# Altium schematic sheet Motor_0307.SchDoc: LKS034DO_FOC_MOTOR
size C; Date: 20220518; DrawnBy: WPJ; Organization: PuXun Tech Co.Ltd.; Revision: V1.0; PageSetup: Record=PageOptions?CenterHorizontal=True?CenterVertical=True?PrintScale=0.54?XCorrection=1.00?YCorrection=1.00?PrintKind=0?BorderSize=5000000?LeftOffset=0?BottomOffset=0?Orientation=2?PaperLength=1000?PaperWidth=1000?Scale=100?PaperSource=7?PrintQuality=-4?MediaType=1?DitherType=10?PaperKind=A4?PrintScaleMode=1
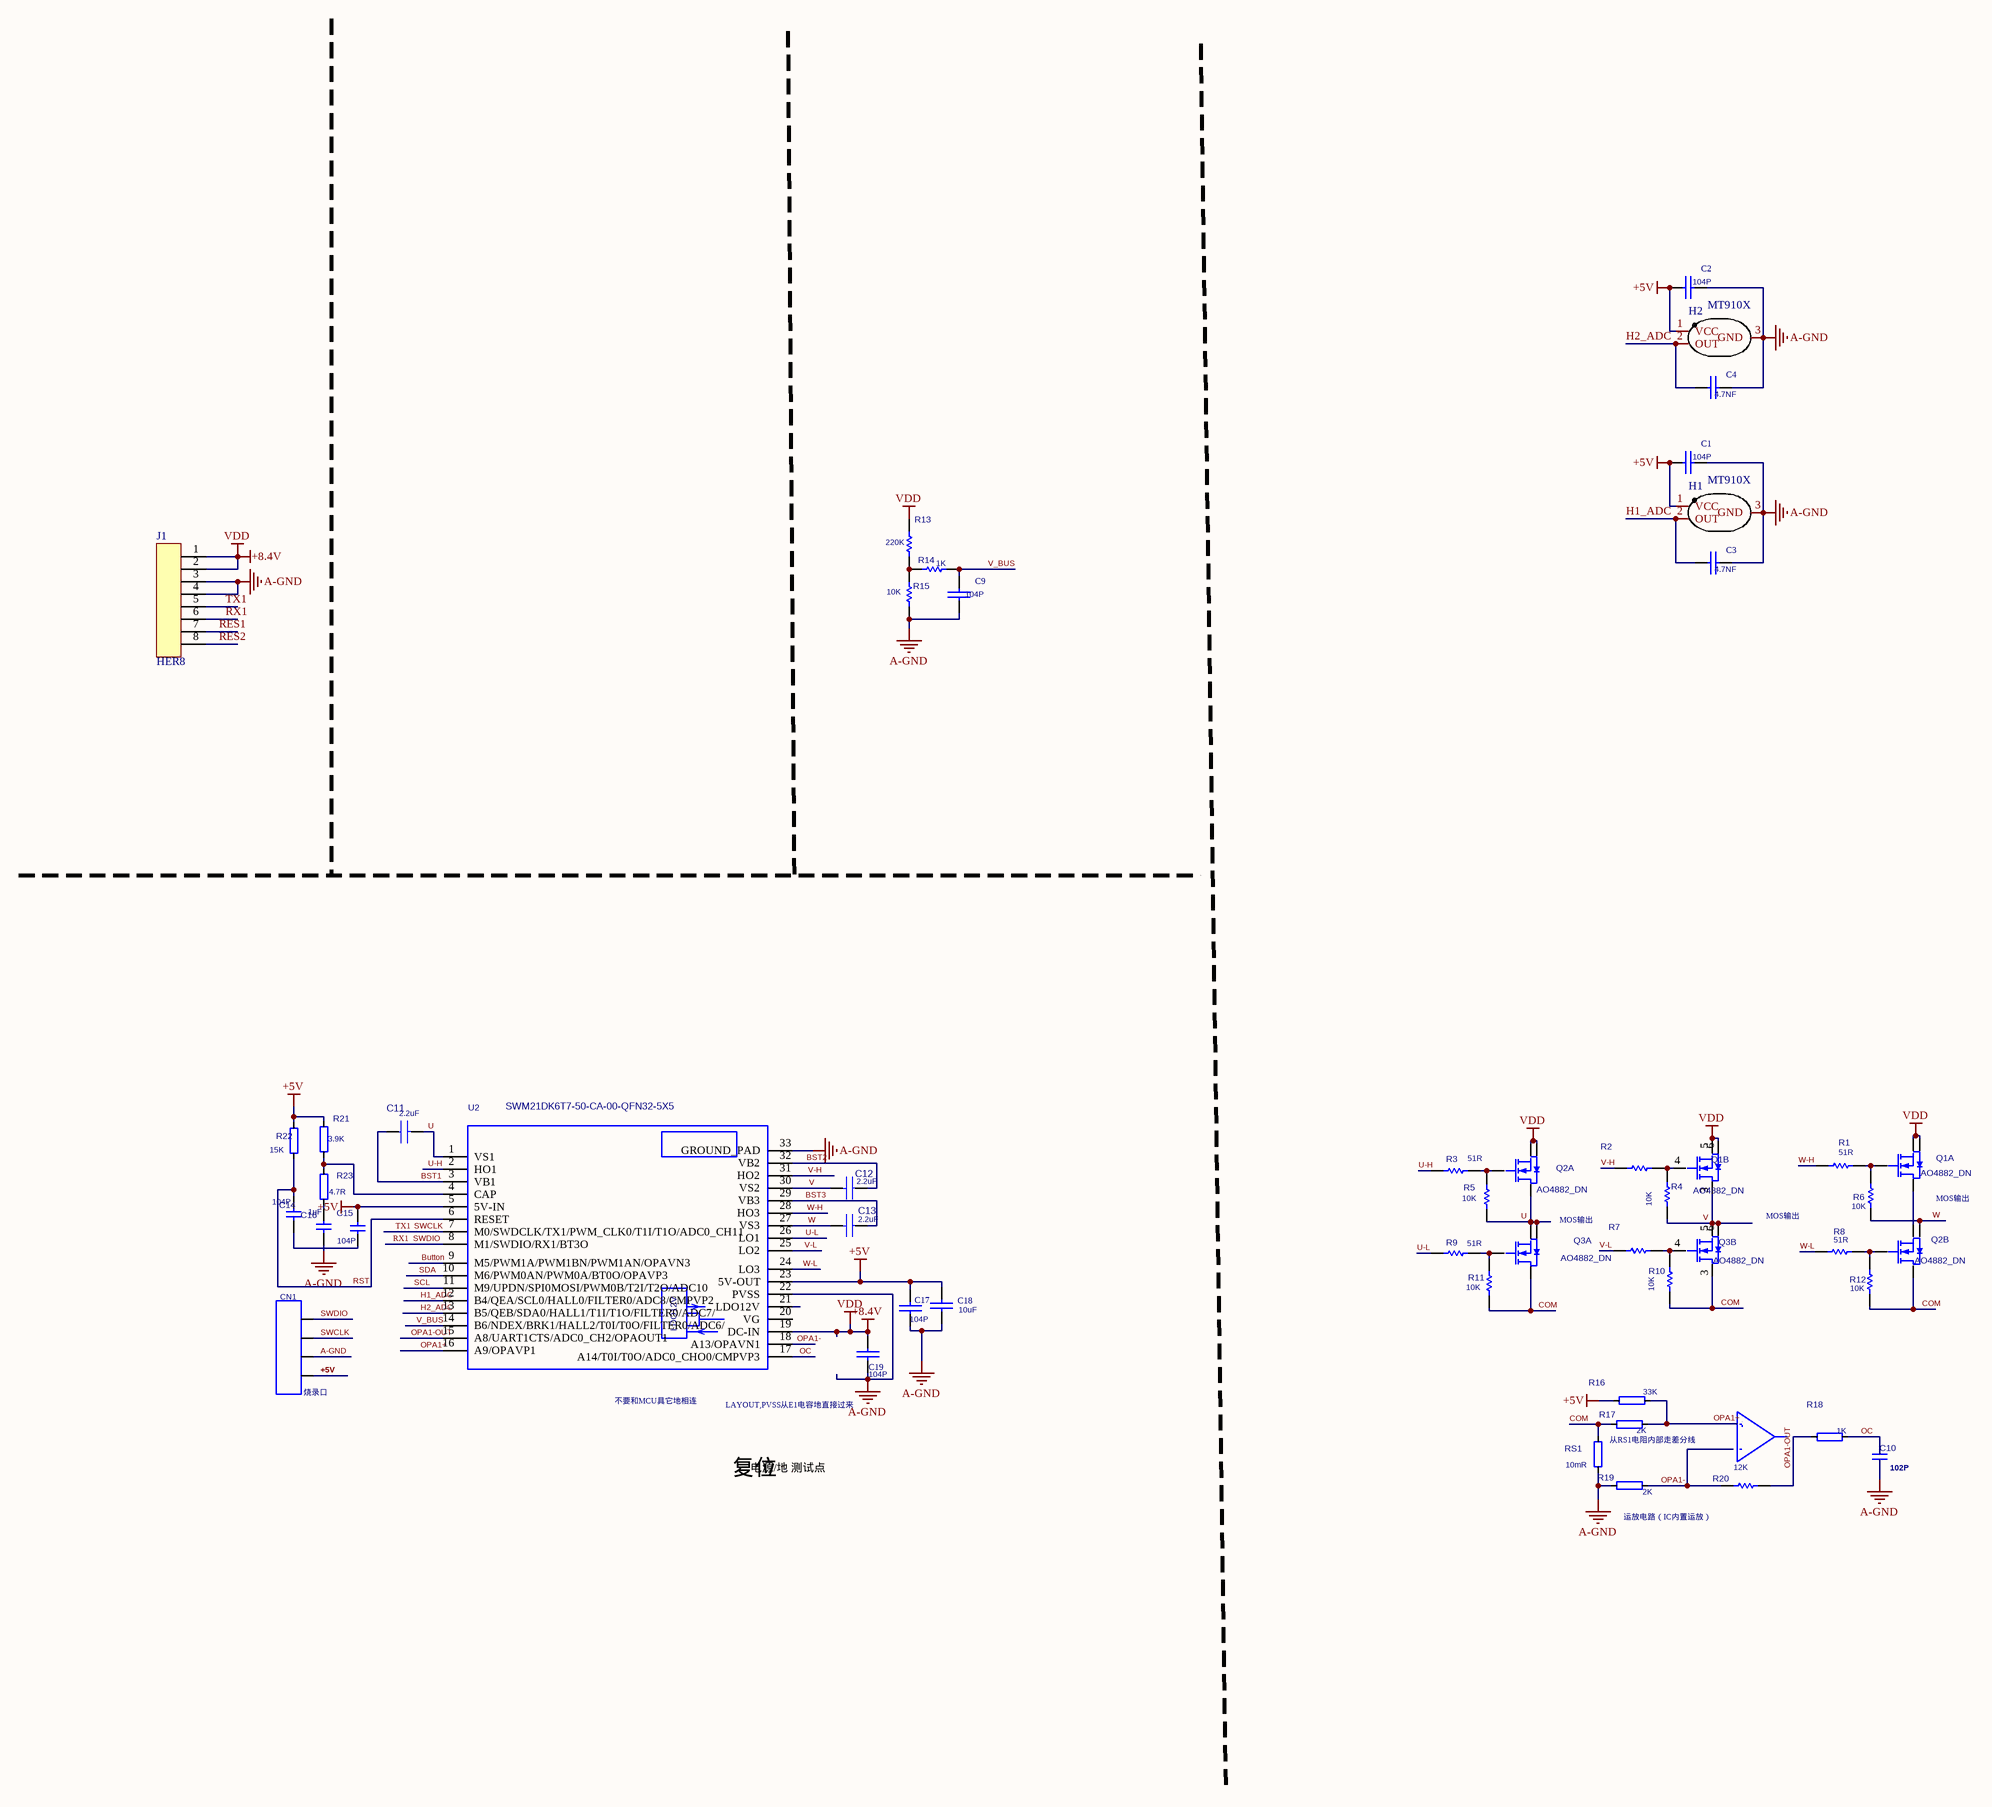
[diagram p0: Motor_0307.SchDoc]

## Parts
C1  104P  [LC-0603_R]
C2  104P  [LC-0603_R]
C3  4.7NF  [LC-0603_R]
C4  4.7NF  [LC-0603_R]
C9  104P  [LC-0603_R]
C10  102P  [LC-0603_R]
C11  2.2uF  [LC-0603_C]
C12  2.2uF  [LC-0603_C]
C13  2.2uF  [LC-0603_C]
C14  104P  [LC-0603_R]
C15  104P  [LC-0603_R]
C16  1uF  [LC-0603_R]
C17  104P  [LC-0603_R]
C18  10uF  [LC-0603_R]
C19  104P  [LC-0603_R]
CN1  4P-2.54-8B  [HDR2.54-LI-4P]  (value not drawn)
H1  MT910X  [SOT23-3]
H2  MT910X  [SOT23-3]
J1  HER8
Q1  AO4882_DN  [LC-SOP-8_150mil]  (parts A,B of 2)
Q2  AO4882_DN  [LC-SOP-8_150mil]  (parts A,B of 2)
Q3  AO4882_DN  [LC-SOP-8_150mil]  (parts A,B of 2)
R1  51R  [LC-0603_R]
R2  51R  [LC-0603_R]  (value not drawn)
R3  51R  [LC-0603_R]
R4  10K  [LC-0603_R]
R5  10K  [LC-0603_R]
R6  10K  [LC-0603_R]
R7  51R  [LC-0603_R]  (value not drawn)
R8  51R  [LC-0603_R]
R9  51R  [LC-0603_R]
R10  10K  [LC-0603_R]
R11  10K  [LC-0603_R]
R12  10K  [LC-0603_R]
R13  220K  [LC-0603_R]
R14  1K  [LC-0603_R]
R15  10K  [LC-0603_R]
R16  33K  [LC-0603_R]
R17  2K  [LC-0603_R]
R18  1K  [LC-0603_R]
R19  2K  [LC-0603_R]
R20  12K  [LC-0603_R]
R21  3.9K  [LC-0603_R]
R22  15K  [LC-0603_R]
R23  4.7R  [LC-0603_R]
RS1  10mR  [LC-1206_R]
U2  QFN32  [QFN32]  (value not drawn)

## Nets
+5V: C1.1 C2.1 C15.1 C17.2 C18.1 CN1.1 H1.1(VCC) H2.1(VCC) R16.2 R21.1 R22.1 U2.5(5V-IN) U2.23(5V-OUT)
+8.4V: C19.2 J1.1 J1.2 Q1.5(D) Q1.6(D) Q1.7(D) Q1.8(D) Q2.7(D) Q2.8(D) R13.2 U2.19(DC-IN)  [also labelled VDD]
A-GND: C1.2 C2.2 C3.2 C4.2 C9.2 C10.1 C16.1 C17.1 C18.2 C19.1 CN1.2 H1.3(GND) H2.3(GND) J1.3 J1.4 R15.2 R19.2 RS1.2 U2.22(PVSS) U2.33(GROUND_PAD)
BST1: C11.1 U2.3(VB1)
BST2: C12.1 U2.32(VB2)
BST3: C13.1 U2.29(VB3)
Button: U2.9(M5/PWM1A/PWM1BN/PWM1AN/OPAVN3)
COM: Q2.3(S) Q3.1(S) Q3.3(S) R10.1 R11.1 R12.1 R17.2 RS1.1
H1_ADC: C3.1 H1.2(OUT) U2.12(B4/QEA/SCL0/HALL0/FILTER0/ADC8/CMPVP2)
H2_ADC: C4.1 H2.2(OUT) U2.13(B5/QEB/SDA0/HALL1/T1I/T1O/FILTER0/ADC7/)
OC: C10.2 R18.1 U2.17(A14/T0I/T0O/ADC0_CHO0/CMPVP3)
OPA1+: R16.1 R17.1 U2.16(A9/OPAVP1)
OPA1-: R19.1 R20.1 U2.18(A13/OPAVN1)
OPA1-OUT: R18.2 R20.2 U2.15(A8/UART1CTS/ADC0_CH2/OPAOUT1)
RES1: J1.7
RES2: J1.8
RST: C14.2 R22.2 U2.6(RESET)
RX1: CN1.4 J1.6 U2.8(M1/SWDIO/RX1/BT3O)  [also labelled SWDIO]
SCL: U2.11(M9/UPDN/SPI0MOSI/PWM0B/T2I/T2O/ADC10)
SDA: U2.10(M6/PWM0AN/PWM0A/BT0O/OPAVP3)
SWCLK: CN1.3 J1.5 U2.7(M0/SWDCLK/TX1/PWM_CLK0/T1I/T1O/ADC0_CH11)  [also labelled TX1]
U: C11.2 Q2.1(S) Q3.7(D) Q3.8(D) R5.1 U2.1(VS1)
U-H: R3.1 U2.2(HO1)
U-L: R9.1 U2.26(LO1)
V: C12.2 Q1.3(S) Q3.5(D) Q3.6(D) R4.1 U2.30(VS2)
V-H: R2.1 U2.31(HO2)
V-L: R7.1 U2.25(LO2)
V_BUS: C9.1 R14.1 U2.14(B6/NDEX/BRK1/HALL2/T0I/T0O/FILTER0/ADC6/)
W: C13.2 Q2.6(D) R6.1 U2.27(VS3)
W-H: R1.1 U2.28(HO3)
W-L: R8.1 U2.24(LO3)
NetC14_1: C14.1 C15.2
NetC16_2: C16.2 R23.2
NetQ1_1: Q1.1(S) Q2.5(D)
NetQ1_2: Q1.2(G) R1.2 R6.2
NetQ1_4: Q1.4(G) R2.2 R4.2
NetQ2_2: Q2.2(G) R3.2 R5.2
NetQ2_4: Q2.4(G) R8.2 R12.2
NetQ3_2: Q3.2(G) R9.2 R11.2
NetQ3_4: Q3.4(G) R7.2 R10.2
NetR13_1: R13.1 R14.2 R15.1
NetR21_2: R21.2 R23.1 U2.4(CAP)

Not connected (* = marked no-connect by the designer): U2 20(VG) 21(LDO12V)

## Notes on the sheet
- MOS输出
- (near CN1) 烧录口
- (near U2) 不要和MCU具它地相连
- (near U2) LAYOUT,PVSS从E1电容地直接过来
- 复位
- 电源/地 测试点
- 从RS1电阻内部走差分线
- (near R19) 运放电路（IC内置运放）
- TITLE：
- SIEZ：C
- VERSION：
- V1.0
- DESIGNER：
- COMPANY：
- DATE：
- (in symbol SWM21DK6U7_QFN32_5X5_BA00) SWM21DK6T7-50-CA-00-QFN32-5X5

## Library data of the parts
C1-C4 C9 = CC: Capacitor; Value: 100pF; PCB DECAL: C0603; Published: 8-Jun-2000; LatestRevisionDate: 17-Jul-2002; LatestRevisionNote: Re-released for DXP Platform.; PackageReference: RAD-0.3; Publisher: Altium Limited; PackageDescription: Radial Cap, Thru-Hole; 2 Leads; 0.3 in Pin Spacing
C10 = C0603: 贴片瓷片电容; Value: 100nF; Published: 8-Jun-2000; LatestRevisionDate: 17-Jul-2002; LatestRevisionNote: Re-released for DXP Platform.; PackageReference: RAD-0.3; Publisher: Altium Limited; PCB DECAL: C0603
C11-C13 = C0805: Capacitor; Part_Shape: 0603; Source_Path: E:\GTCS-A01-SWM-P9项目\GTCS-A01-SWM-P9项目V1.2\GTCS-A01-SWM-P9-V1.2.原理图\99.DSN; Published: 8-Jun-2000; LatestRevisionDate: 17-Jul-2002; LatestRevisionNote: Re-released for DXP Platform.; PackageReference: RAD-0.3; Publisher: Altium Limited; PackageDescription: Radial Cap, Thru-Hole; 2 Leads; 0.3 in Pin Spacing; Value: 2.2uF; PCB DECAL: C0805
C14-C16 = CAP_S: PCB DECAL: C_0402
C17 C19 = CC: Capacitor; PCB DECAL: C0805; SMD/DIP/WELDING: SMD
C18 = CC: Capacitor; PCB DECAL: C0805
CN1 = 4P-2.54-8: 接插件  DS-5.1CN4  DS-2.54CWB-4; PCB DECAL: 4P-2.54-8
Q1-Q3 = AO4882_DN_SOP8: MOS(场效应管)
R1-R13 R15 R20 = RES_SEMI: Semiconductor Resistor; Value: 1K; PCB DECAL: R0603; Published: 8-Jun-2000; LatestRevisionDate: 17-Jul-2002; LatestRevisionNote: Re-released for DXP Platform.; PackageReference: AXIAL-0.5; Publisher: Altium Limited; PackageDescription: Axial Device, Thru-Hole; 2 Leads; 0.5 in Pin Spacing
R14 = RES_SEMI: Semiconductor Resistor; PCB DECAL: R0603; Published: 8-Jun-2000; LatestRevisionDate: 17-Jul-2002; LatestRevisionNote: Re-released for DXP Platform.; PackageReference: AXIAL-0.5; Publisher: Altium Limited; PackageDescription: Axial Device, Thru-Hole; 2 Leads; 0.5 in Pin Spacing; Value: 1K
R16 R17 R19 = RR: 贴片 电阻器; Value: 1K; PCB DECAL: R0603; SMD/DIP/WELDING: SMD; Published: 8-Jun-2000; LatestRevisionDate: 17-Jul-2002; LatestRevisionNote: Re-released for DXP Platform.; PackageReference: AXIAL-0.5; Publisher: Altium Limited; PackageDescription: Axial Device, Thru-Hole; 2 Leads; 0.5 in Pin Spacing
R18 = RR: 贴片 电阻器; PCB DECAL: R0603; SMD/DIP/WELDING: SMD; Published: 8-Jun-2000; LatestRevisionDate: 17-Jul-2002; LatestRevisionNote: Re-released for DXP Platform.; PackageReference: AXIAL-0.5; Publisher: Altium Limited; PackageDescription: Axial Device, Thru-Hole; 2 Leads; 0.5 in Pin Spacing; Value: 1K
R21-R23 = RR: 贴片 电阻器; PCB DECAL: R0402; SMD/DIP/WELDING: SMD
RS1 = RR: 贴片 电阻器; Value: 1K; PCB DECAL: 1206R; SMD/DIP/WELDING: SMD; Published: 8-Jun-2000; LatestRevisionDate: 17-Jul-2002; LatestRevisionNote: Re-released for DXP Platform.; PackageReference: AXIAL-0.5; Publisher: Altium Limited; PackageDescription: Axial Device, Thru-Hole; 2 Leads; 0.5 in Pin Spacing
U2 = SWM21DK6U7_QFN32_5X5_BA00: 微控制器, Cortex-M0系列; PCB DECAL: SWM21DK6U7_QFN32_5X5_BA00